# EasyEDA schematic bappr_easyeda_file_source.json
TITLE: BAPPR; REV: 1.0; Date: 2024-06-21; Sheet: 1/1; Drawn By: The Mariday; Company: Mariday Industries
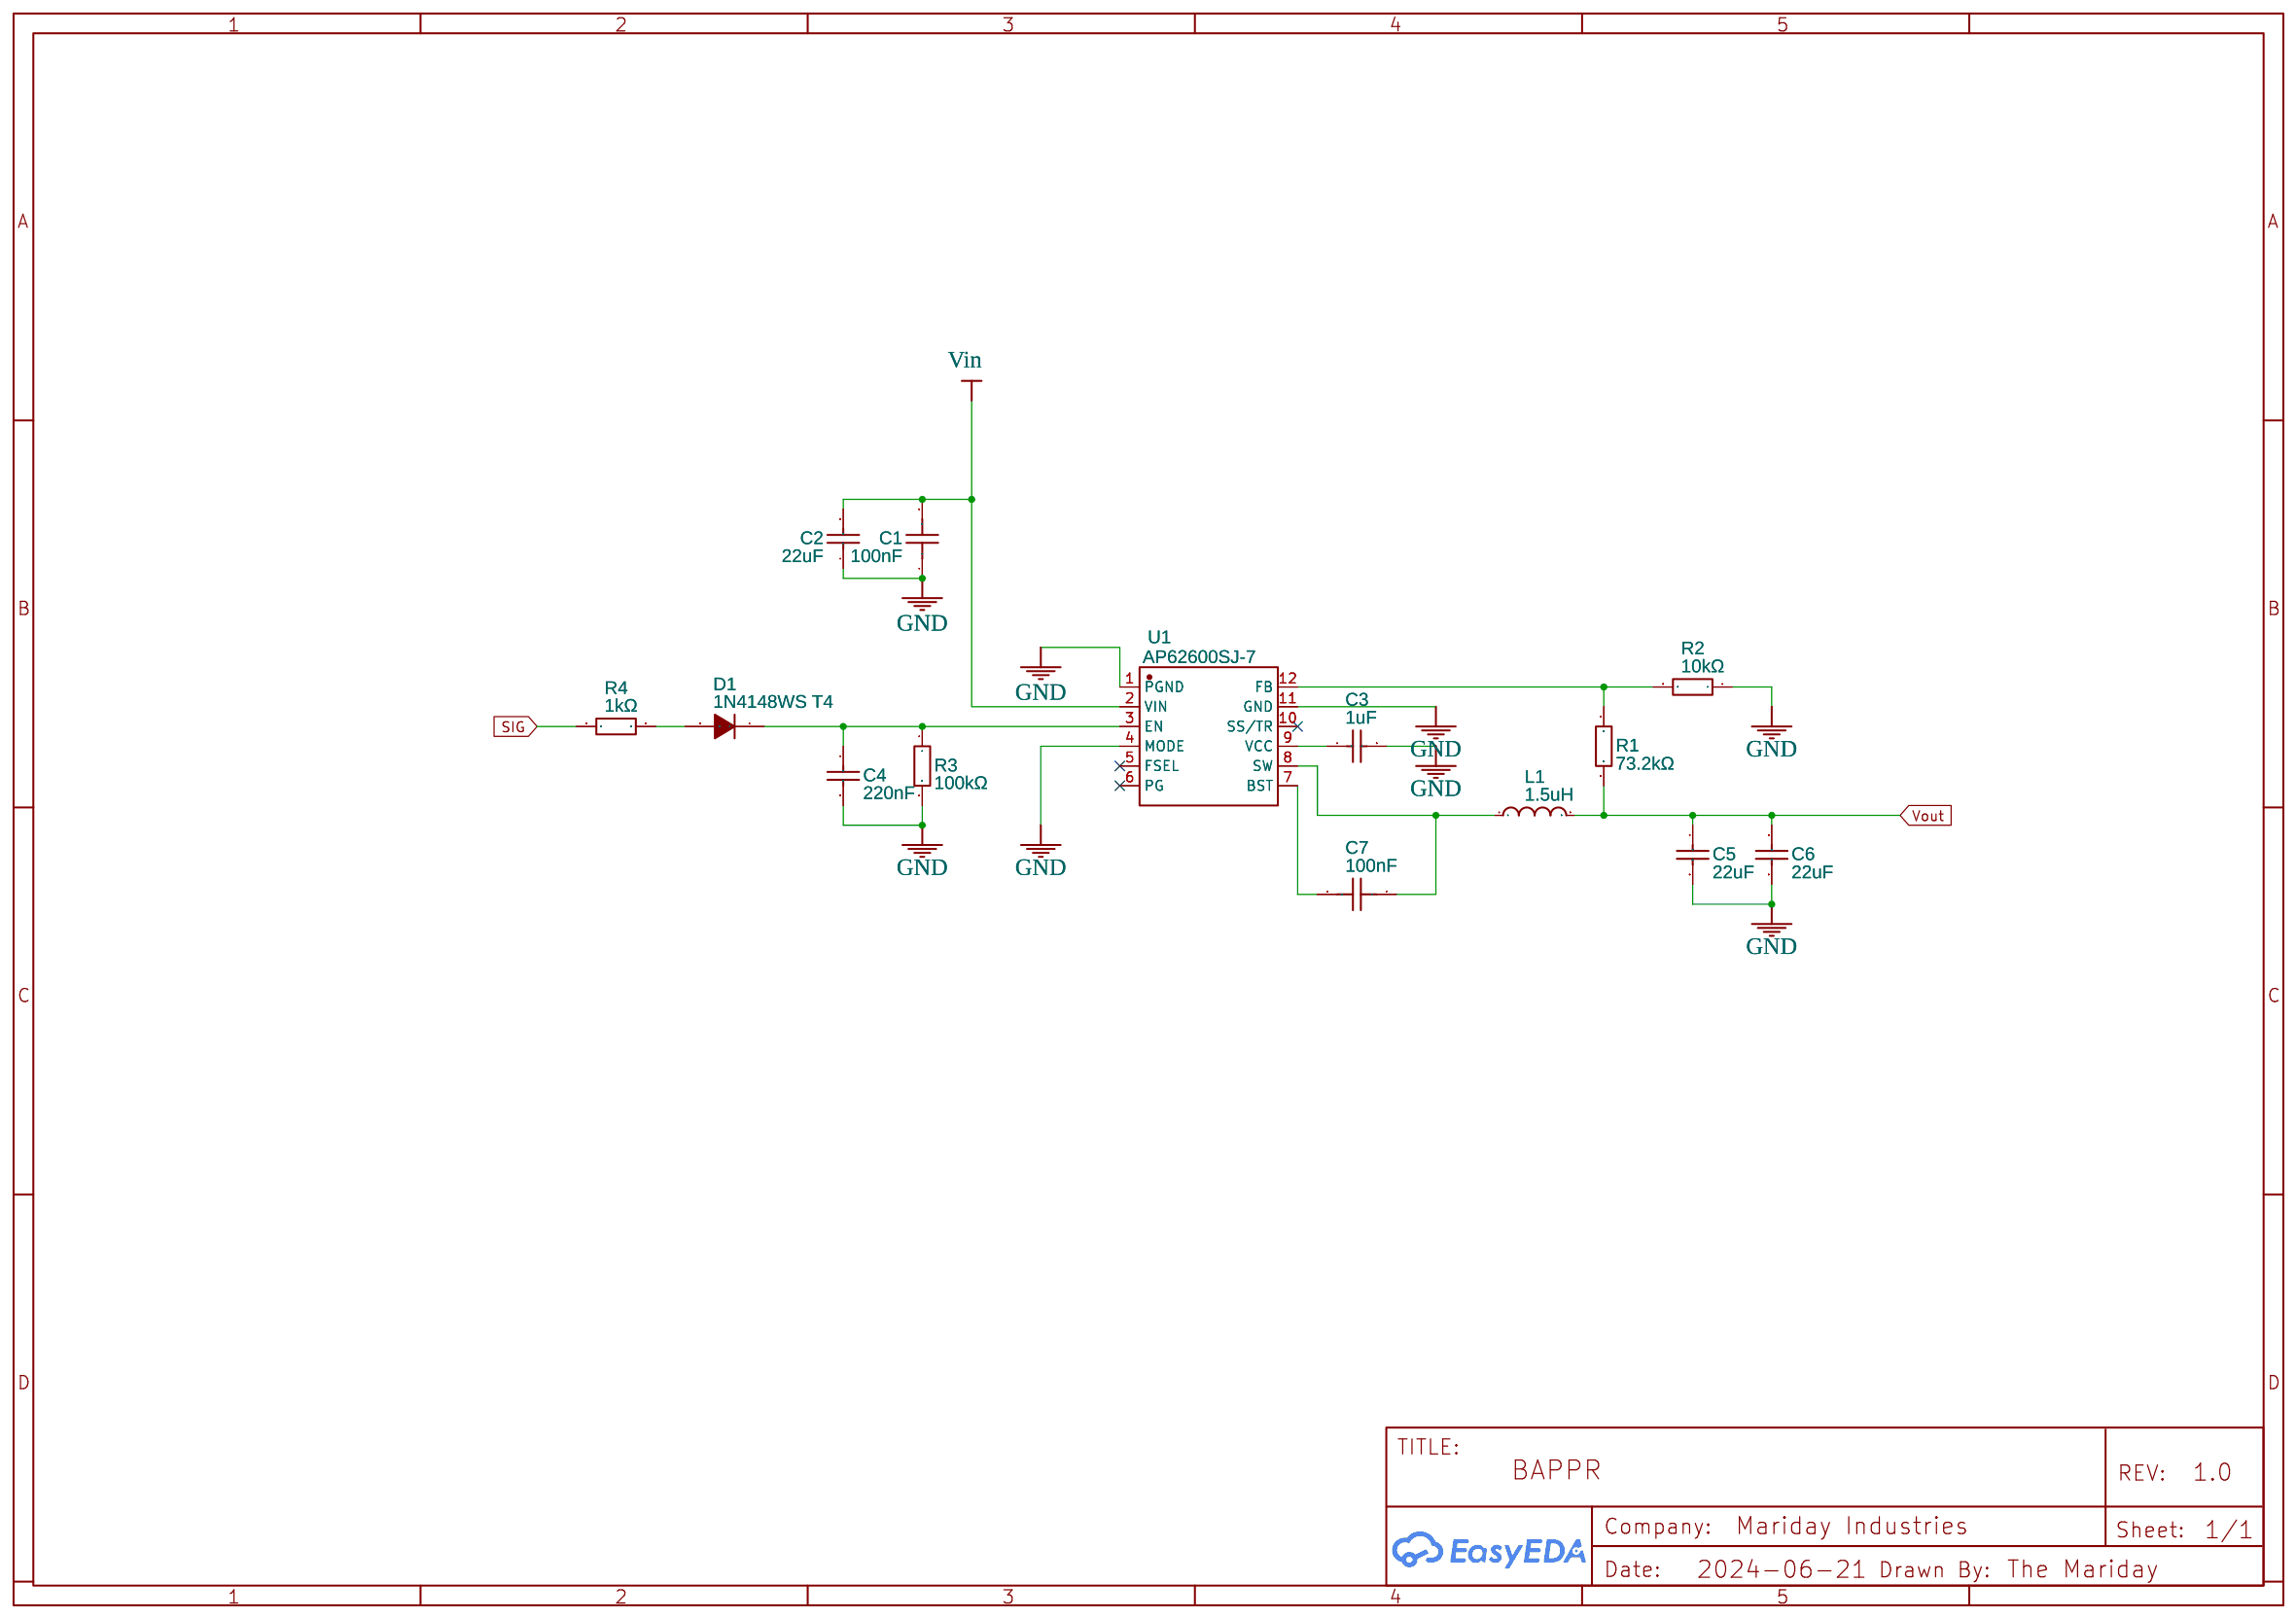
[diagram p0: schematic sheet]

## Parts
C1  100nF  [C0603]
C2  22uF  [C1206]
C3  1uF  [C0603]
C4  220nF  [C0603]
C5  22uF  [C1206]
C6  22uF  [C1206]
C7  100nF  [C0603]
D1  1N4148WS T4  [SOD-323_L1.8-W1.3-LS2.5-RD]
L1  1.5uH  [IND-SMD_L6.5-W6.5_VISHAY]
R1  73.2kΩ  [R0603]
R2  10kΩ  [R0603]
R3  100kΩ  [R0603]
R4  1kΩ  [R0603]
U1  AP62600SJ-7  [QFN-12_L3.0-W2.0-P0.50-TL_AP62600SJ-7]

## Library data of the parts
C1 C7 = CC0603KRX7R9BB104: Supplier: LCSC; Manufacturer: YAGEO(国巨); Supplier Part: C14663; JLCPCB Part Class: Basic Part
C2 C5 C6 = CL31A226KAHNNNE: Supplier: LCSC; Manufacturer: SAMSUNG(三星); Supplier Part: C12891; JLCPCB Part Class: Basic Part
C3 = CL10A105KB8NNNC: Supplier: LCSC; Manufacturer: SAMSUNG(三星); Supplier Part: C15849; JLCPCB Part Class: Basic Part
C4 = CL10B224KA8NNNC: Supplier: LCSC; Manufacturer: SAMSUNG(三星); Supplier Part: C21120; JLCPCB Part Class: Basic Part; link: https://lcsc.com/eda_search?q=C21120&%26type=1&ref=editor
D1 = 1N4148WS T4: Supplier: LCSC; Manufacturer: CJ(江苏长电/长晶); Manufacturer Part: 1N4148WS; Supplier Part: C2128; JLCPCB Part Class: Basic Part
L1 = IHLP2525CZER1R5M01: Supplier: LCSC; Supplier Part: C845020; Manufacturer: VISHAY(威世); JLCPCB Part Class: Extended Part; Contributor: LCSC
R1 = 0603WAF7322T5E: Supplier: LCSC; Manufacturer: UNI-ROYAL(厚声); Supplier Part: C14890; Resistance (Ohms): 73.2K; JLCPCB Part Class: Extended Part
R2 = 0603WAF1002T5E: Supplier: LCSC; Manufacturer: UNI-ROYAL(厚声); Supplier Part: C25804; Resistance (Ohms): 10K; JLCPCB Part Class: Basic Part
R3 = 0603WAF1003T5E: Supplier: LCSC; Manufacturer: UNI-ROYAL(厚声); Supplier Part: C25803; Resistance (Ohms): 100K; JLCPCB Part Class: Basic Part
R4 = 0603WAF1001T5E: Supplier: LCSC; Manufacturer: UNI-ROYAL(厚声); Supplier Part: C21190; Resistance (Ohms): 1K; JLCPCB Part Class: Basic Part
U1 = AP62600SJ-7: Supplier: LCSC; Supplier Part: C4748917; Manufacturer: DIODES(美台); Contributor: lcsc; JLCPCB Part Class: Extended Part

## Nets
GND: C1.1 C2.1 C3.2 C4.2 C5.2 C6.2 R2.1 R3.2 U1.1(PGND) U1.4(MODE) U1.11(GND)
Vin: C1.2 C2.2 U1.2(VIN)
SIG: R4.1
Vout: C5.1 C6.1 L1.2 R1.2
Net-(C3-1): C3.1 U1.9(VCC)
Net-(C4-1): C4.1 D1.1(K) R3.1 U1.3(EN)
Net-(C7-1): C7.1 L1.1 U1.8(SW)
Net-(C7-2): C7.2 U1.7(BST)
Net-(D1-2): D1.2(A) R4.2
Net-(R1-1): R1.1 R2.2 U1.12(FB)

Not connected (* = marked no-connect by the designer): U1 5(FSEL)* 6(PG)* 10(SS/TR)*
